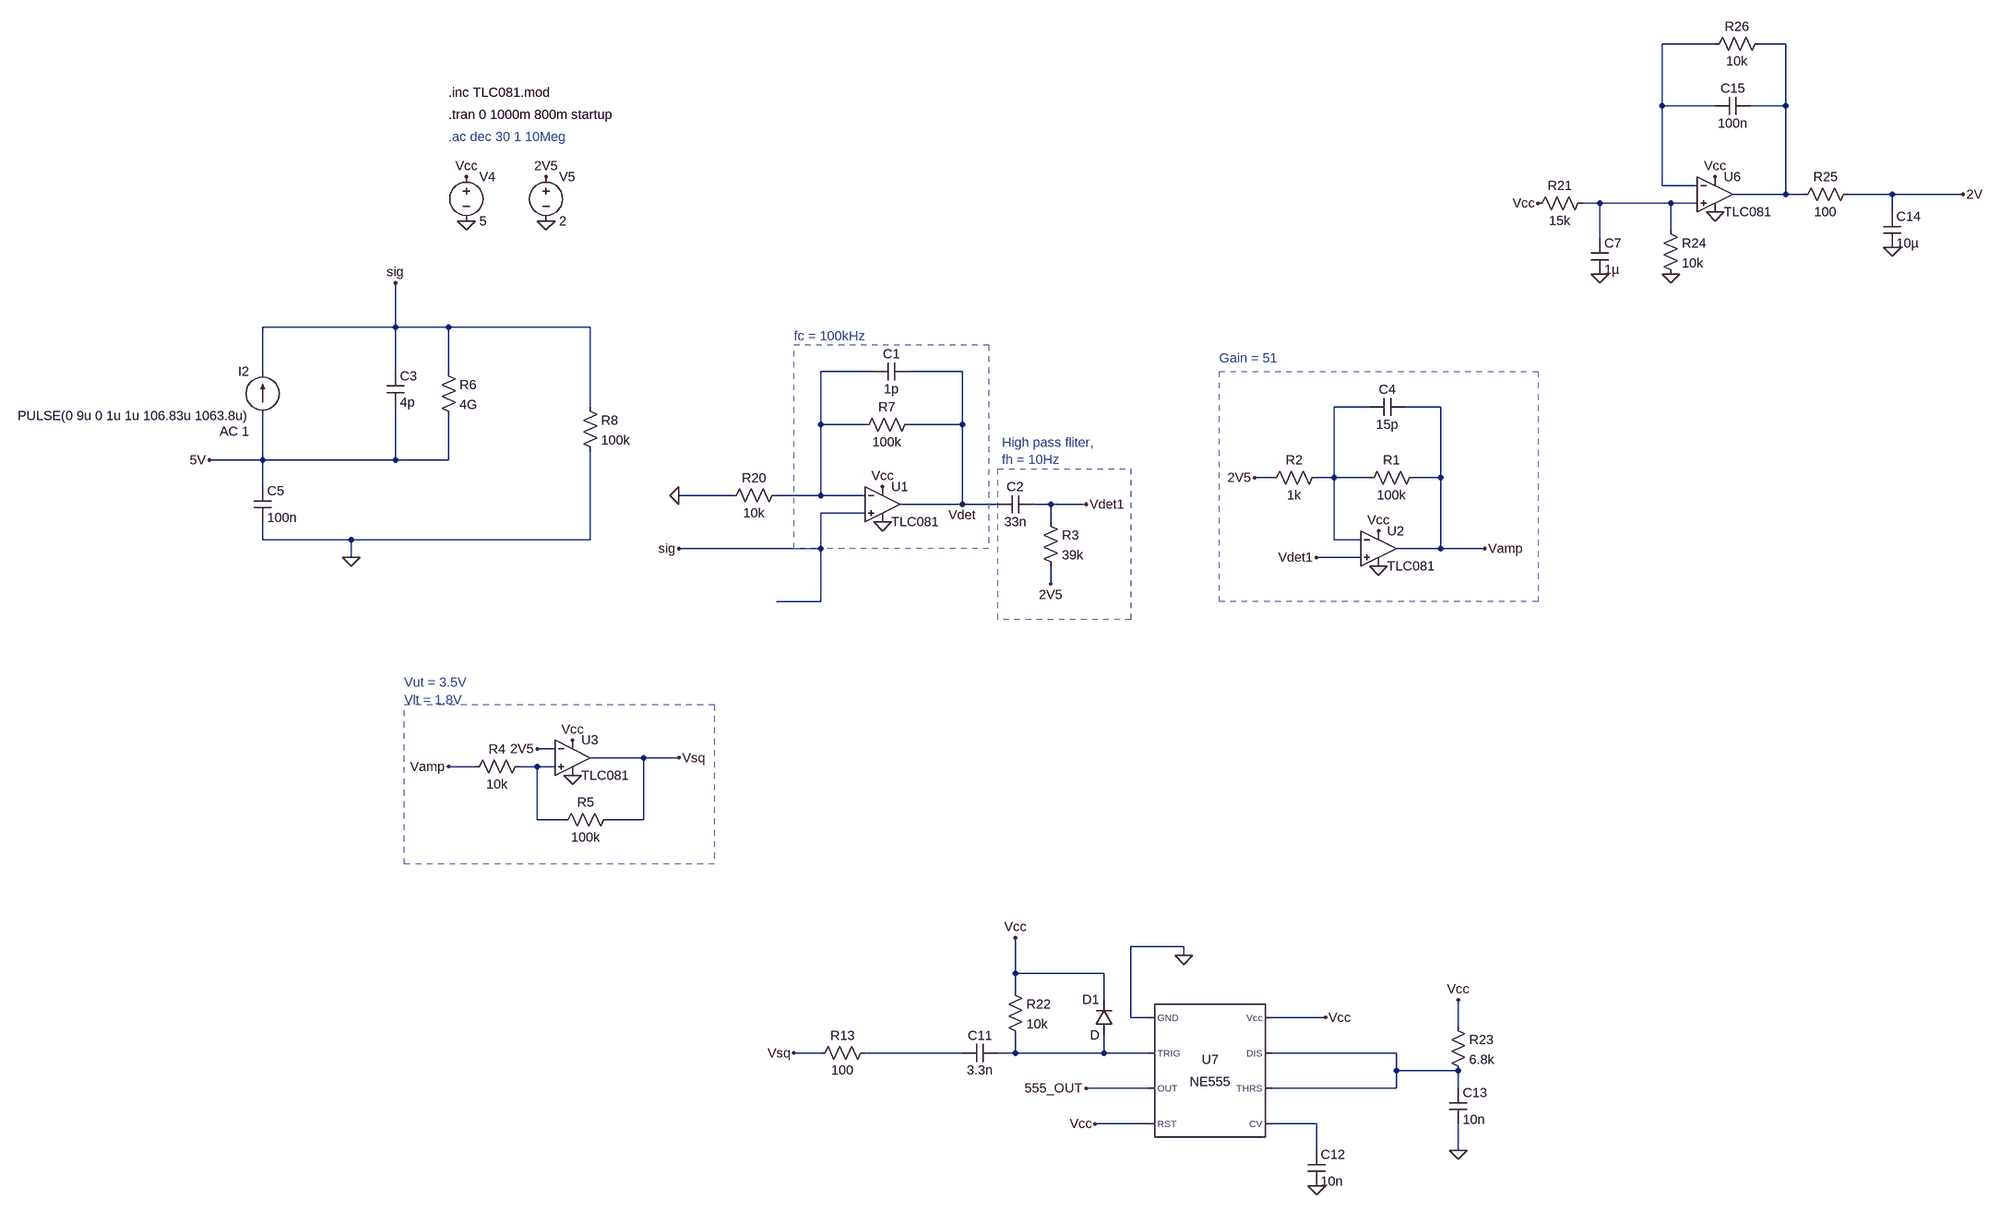
[diagram p0: schematic Receiver_updated - Alexander.asc]
Receiver_updated - Alexander.asc, the LTspice schematic file:
Version 4.1
SHEET 1 5412 2404
WIRE 1296 144 1200 144
WIRE 1424 144 1376 144
WIRE 1200 256 1200 144
WIRE 1296 256 1200 256
WIRE 1424 256 1424 144
WIRE 1424 256 1360 256
WIRE 1200 400 1200 256
WIRE 1264 400 1200 400
WIRE 1424 416 1424 256
WIRE 1424 416 1328 416
WIRE 1456 416 1424 416
WIRE 1616 416 1536 416
WIRE 1744 416 1616 416
WIRE 1088 432 1056 432
WIRE 1216 432 1088 432
WIRE 1264 432 1216 432
WIRE 1616 448 1616 416
WIRE 1216 480 1216 432
WIRE 1088 496 1088 432
WIRE -1088 656 -1088 576
WIRE -1088 656 -1328 656
WIRE -992 656 -1088 656
WIRE -736 656 -992 656
WIRE -1328 736 -1328 656
WIRE -1088 736 -1088 656
WIRE -992 736 -992 656
WIRE -224 736 -320 736
WIRE -64 736 -160 736
WIRE -736 800 -736 656
WIRE 672 800 608 800
WIRE 800 800 736 800
WIRE -320 832 -320 736
WIRE -240 832 -320 832
WIRE -64 832 -64 736
WIRE -64 832 -160 832
WIRE -1328 896 -1328 816
WIRE -1328 896 -1424 896
WIRE -1088 896 -1088 800
WIRE -1088 896 -1328 896
WIRE -992 896 -992 816
WIRE -992 896 -1088 896
WIRE 496 928 464 928
WIRE 608 928 608 800
WIRE 608 928 576 928
WIRE 672 928 608 928
WIRE 800 928 800 800
WIRE 800 928 752 928
WIRE -1328 944 -1328 896
WIRE -480 960 -576 960
WIRE -320 960 -320 832
WIRE -320 960 -400 960
WIRE -240 960 -320 960
WIRE -64 976 -64 832
WIRE -64 976 -176 976
WIRE 0 976 -64 976
WIRE 96 976 64 976
WIRE 160 976 96 976
WIRE -240 992 -320 992
WIRE 96 1008 96 976
WIRE -1328 1040 -1328 1008
WIRE -1168 1040 -1328 1040
WIRE -736 1040 -736 880
WIRE -736 1040 -1168 1040
WIRE 608 1040 608 928
WIRE 656 1040 608 1040
WIRE -320 1056 -320 992
WIRE -320 1056 -576 1056
WIRE 800 1056 800 928
WIRE 800 1056 720 1056
WIRE 880 1056 800 1056
WIRE -1168 1072 -1168 1040
WIRE 656 1072 576 1072
WIRE 96 1120 96 1088
WIRE -320 1152 -320 1056
WIRE -320 1152 -400 1152
WIRE -800 1488 -832 1488
WIRE -640 1504 -736 1504
WIRE -576 1504 -640 1504
WIRE -944 1520 -992 1520
WIRE -832 1520 -864 1520
WIRE -800 1520 -832 1520
WIRE -832 1616 -832 1520
WIRE -784 1616 -832 1616
WIRE -640 1616 -640 1504
WIRE -640 1616 -704 1616
WIRE 336 1952 240 1952
WIRE 336 1968 336 1952
WIRE 32 2000 32 1936
WIRE 192 2000 32 2000
WIRE 32 2032 32 2000
WIRE 192 2048 192 2000
WIRE 240 2080 240 1952
WIRE 272 2080 240 2080
WIRE 592 2080 496 2080
WIRE 832 2096 832 2048
WIRE -320 2144 -368 2144
WIRE -64 2144 -240 2144
WIRE 32 2144 32 2112
WIRE 32 2144 0 2144
WIRE 192 2144 192 2112
WIRE 192 2144 32 2144
WIRE 272 2144 192 2144
WIRE 720 2144 496 2144
WIRE 720 2176 720 2144
WIRE 832 2176 720 2176
WIRE 272 2208 160 2208
WIRE 720 2208 720 2176
WIRE 720 2208 496 2208
WIRE 832 2208 832 2176
WIRE 272 2272 176 2272
WIRE 576 2272 496 2272
WIRE 576 2320 576 2272
WIRE 832 2320 832 2272
FLAG -208 1008 0
FLAG -208 944 Vcc
FLAG -960 464 0
FLAG -960 384 Vcc
FLAG -816 464 0
FLAG -816 384 2V5
FLAG 464 928 2V5
FLAG 688 1088 0
FLAG 688 1024 Vcc
FLAG 576 1072 Vdet1
FLAG 96 1120 2V5
FLAG 160 976 Vdet1
FLAG -64 976 Vdet
FLAG 880 1056 Vamp
FLAG -768 1472 Vcc
FLAG -768 1536 0
FLAG -992 1520 Vamp
FLAG -832 1488 2V5
FLAG -576 1504 Vsq
FLAG -1088 576 sig
FLAG -576 960 0
FLAG -576 1056 sig
FLAG -1424 896 5V
FLAG -1168 1072 0
FLAG 1296 448 0
FLAG 1296 384 Vcc
FLAG -368 2144 Vsq
FLAG 336 1968 0
FLAG 592 2080 Vcc
FLAG 32 1936 Vcc
FLAG 576 2384 0
FLAG 176 2272 Vcc
FLAG 160 2208 555_OUT
FLAG 832 2048 Vcc
FLAG 832 2320 0
FLAG 1744 416 2V
FLAG 1616 512 0
FLAG 1216 560 0
FLAG 1088 560 0
FLAG 976 432 Vcc
SYMBOL cap -1104 736 R0
SYMATTR InstName C3
SYMATTR Value 4p
SYMBOL res -1008 720 R0
SYMATTR InstName R6
SYMATTR Value 4G
SYMBOL res -144 816 R90
WINDOW 0 0 56 VBottom 2
WINDOW 3 32 56 VTop 2
SYMATTR InstName R7
SYMATTR Value 100k
SYMBOL voltage -960 368 R0
SYMATTR InstName V4
SYMATTR Value 5
SYMBOL voltage -816 368 R0
WINDOW 123 0 0 Left 0
WINDOW 39 0 0 Left 0
SYMATTR InstName V5
SYMATTR Value 2
SYMBOL cap -160 720 R90
WINDOW 0 0 32 VBottom 2
WINDOW 3 32 32 VTop 2
SYMATTR InstName C1
SYMATTR Value 1p
SYMBOL res 768 912 R90
WINDOW 0 0 56 VBottom 2
WINDOW 3 32 56 VTop 2
SYMATTR InstName R1
SYMATTR Value 100k
SYMBOL res 592 912 R90
WINDOW 0 0 56 VBottom 2
WINDOW 3 32 56 VTop 2
SYMATTR InstName R2
SYMATTR Value 1k
SYMBOL cap 64 960 R90
WINDOW 0 0 32 VBottom 2
WINDOW 3 32 32 VTop 2
SYMATTR InstName C2
SYMATTR Value 33n
SYMBOL res 80 992 R0
SYMATTR InstName R3
SYMATTR Value 39k
SYMBOL cap 736 784 R90
WINDOW 0 0 32 VBottom 2
WINDOW 3 32 32 VTop 2
SYMATTR InstName C4
SYMATTR Value 15p
SYMBOL res -848 1504 R90
WINDOW 0 0 56 VBottom 2
WINDOW 3 32 56 VTop 2
SYMATTR InstName R4
SYMATTR Value 10k
SYMBOL res -688 1600 R90
WINDOW 0 0 56 VBottom 2
WINDOW 3 32 56 VTop 2
SYMATTR InstName R5
SYMATTR Value 100k
SYMBOL OpAmps\\opamp2 -208 912 R0
SYMATTR InstName U1
SYMATTR Value TLC081
SYMBOL OpAmps\\opamp2 688 992 R0
SYMATTR InstName U2
SYMATTR Value TLC081
SYMBOL OpAmps\\opamp2 -768 1440 R0
SYMATTR InstName U3
SYMATTR Value TLC081
SYMBOL res -384 944 R90
WINDOW 0 0 56 VBottom 2
WINDOW 3 32 56 VTop 2
SYMATTR InstName R20
SYMATTR Value 10k
SYMBOL current -1328 816 R180
WINDOW 0 24 80 Left 2
WINDOW 3 24 0 Left 2
WINDOW 123 24 -28 Left 2
WINDOW 39 0 0 Left 0
SYMATTR InstName I2
SYMATTR Value PULSE(0 9u 0 1u 1u 106.83u 1063.8u)
SYMATTR Value2 AC 1
SYMBOL res -752 784 R0
SYMATTR InstName R8
SYMATTR Value 100k
SYMBOL OpAmps\\opamp2 1296 352 R0
SYMATTR InstName U6
SYMATTR Value TLC081
SYMBOL res -224 2128 R90
WINDOW 0 0 56 VBottom 2
WINDOW 3 32 56 VTop 2
SYMATTR InstName R13
SYMATTR Value 100
SYMBOL cap 0 2128 R90
WINDOW 0 0 32 VBottom 2
WINDOW 3 32 32 VTop 2
SYMATTR InstName C11
SYMATTR Value 3.3n
SYMBOL diode 208 2112 R180
WINDOW 0 24 64 Left 2
WINDOW 3 24 0 Left 2
SYMATTR InstName D1
SYMBOL Misc\\NE555 384 2176 R0
SYMATTR InstName U7
SYMBOL cap 560 2320 R0
SYMATTR InstName C12
SYMATTR Value 10n
SYMBOL res 816 2080 R0
SYMATTR InstName R23
SYMATTR Value 6.8k
SYMBOL cap 816 2208 R0
SYMATTR InstName C13
SYMATTR Value 10n
SYMBOL res 16 2016 R0
SYMATTR InstName R22
SYMATTR Value 10k
SYMBOL cap 1072 496 R0
SYMATTR InstName C7
SYMATTR Value 1µ
SYMBOL res 1072 416 R90
WINDOW 0 0 56 VBottom 2
WINDOW 3 32 56 VTop 2
SYMATTR InstName R21
SYMATTR Value 15k
SYMBOL res 1200 464 R0
SYMATTR InstName R24
SYMATTR Value 10k
SYMBOL res 1552 400 R90
WINDOW 0 0 56 VBottom 2
WINDOW 3 32 56 VTop 2
SYMATTR InstName R25
SYMATTR Value 100
SYMBOL cap 1600 448 R0
SYMATTR InstName C14
SYMATTR Value 10µ
SYMBOL cap 1360 240 R90
WINDOW 0 0 32 VBottom 2
WINDOW 3 32 32 VTop 2
SYMATTR InstName C15
SYMATTR Value 100n
SYMBOL res 1392 128 R90
WINDOW 0 0 56 VBottom 2
WINDOW 3 32 56 VTop 2
SYMATTR InstName R26
SYMATTR Value 10k
SYMBOL cap -1344 944 R0
SYMATTR InstName C5
SYMATTR Value 100n
TEXT -992 272 Left 2 !.tran 0 1000m 800m startup
TEXT -992 232 Left 2 !.inc TLC081.mod
TEXT -368 672 Left 2 ;fc = 100kHz
TEXT 8 864 Left 2 ;High pass fliter,\nfh = 10Hz
TEXT 400 712 Left 2 ;Gain = 51
TEXT -992 312 Left 2 ;.ac dec 30 1 10Meg
TEXT -1072 1368 Left 2 ;Vut = 3.5V\nVlt = 1.8V
RECTANGLE Normal -16 1056 -368 688 2
RECTANGLE Normal 240 1184 0 912 2
RECTANGLE Normal 976 1152 400 736 2
RECTANGLE Normal -512 1696 -1072 1408 2

The netlist it stands for:
* Receiver_updated - Alexander.asc
C3 sig 5V 4p
R6 sig 5V 4G
R7 Vdet N004 100k
V4 Vcc 0 5
V5 2V5 0 2
C1 Vdet N004 1p
R1 Vamp N005 100k
R2 N005 2V5 1k
C2 Vdet1 Vdet 33n
R3 Vdet1 2V5 39k
C4 Vamp N005 15p
R4 N006 Vamp 10k
R5 Vsq N006 100k
X§U1 sig N004 Vcc 0 Vdet TLC081  ; pins In+ In- V+ V- OUT
X§U2 Vdet1 N005 Vcc 0 Vamp TLC081  ; pins In+ In- V+ V- OUT
X§U3 N006 2V5 Vcc 0 Vsq TLC081  ; pins In+ In- V+ V- OUT
R20 N004 0 10k
I2 5V sig PULSE(0 9u 0 1u 1u 106.83u 1063.8u) AC 1
R8 sig 0 100k
X§U6 N003 N001 Vcc 0 N002 TLC081  ; pins In+ In- V+ V- OUT
R13 N007 Vsq 100
C11 N008 N007 3.3n
D1 N008 Vcc D
X§U7 0 N008 555_OUT Vcc N010 N009 N009 Vcc NE555  ; pins GND TRIG OUT RST CV THRS DIS Vcc
C12 N010 0 10n
R23 Vcc N009 6.8k
C13 N009 0 10n
R22 Vcc N008 10k
C7 N003 0 1µ
R21 N003 Vcc 15k
R24 N003 0 10k
R25 2V N002 100
C14 2V 0 10µ
C15 N002 N001 100n
R26 N002 N001 10k
C5 5V 0 100n
.model D D
.lib standard.dio
.tran 0 1000m 800m startup
.inc TLC081.mod
* fc = 100kHz
* High pass fliter,
* fh = 10Hz
* Gain = 51
* .ac dec 30 1 10Meg
* Vut = 3.5V
* Vlt = 1.8V
.lib NE555.sub
.backanno
.end